# EAGLE design electretAmplifier (EAGLE 7.0.0)
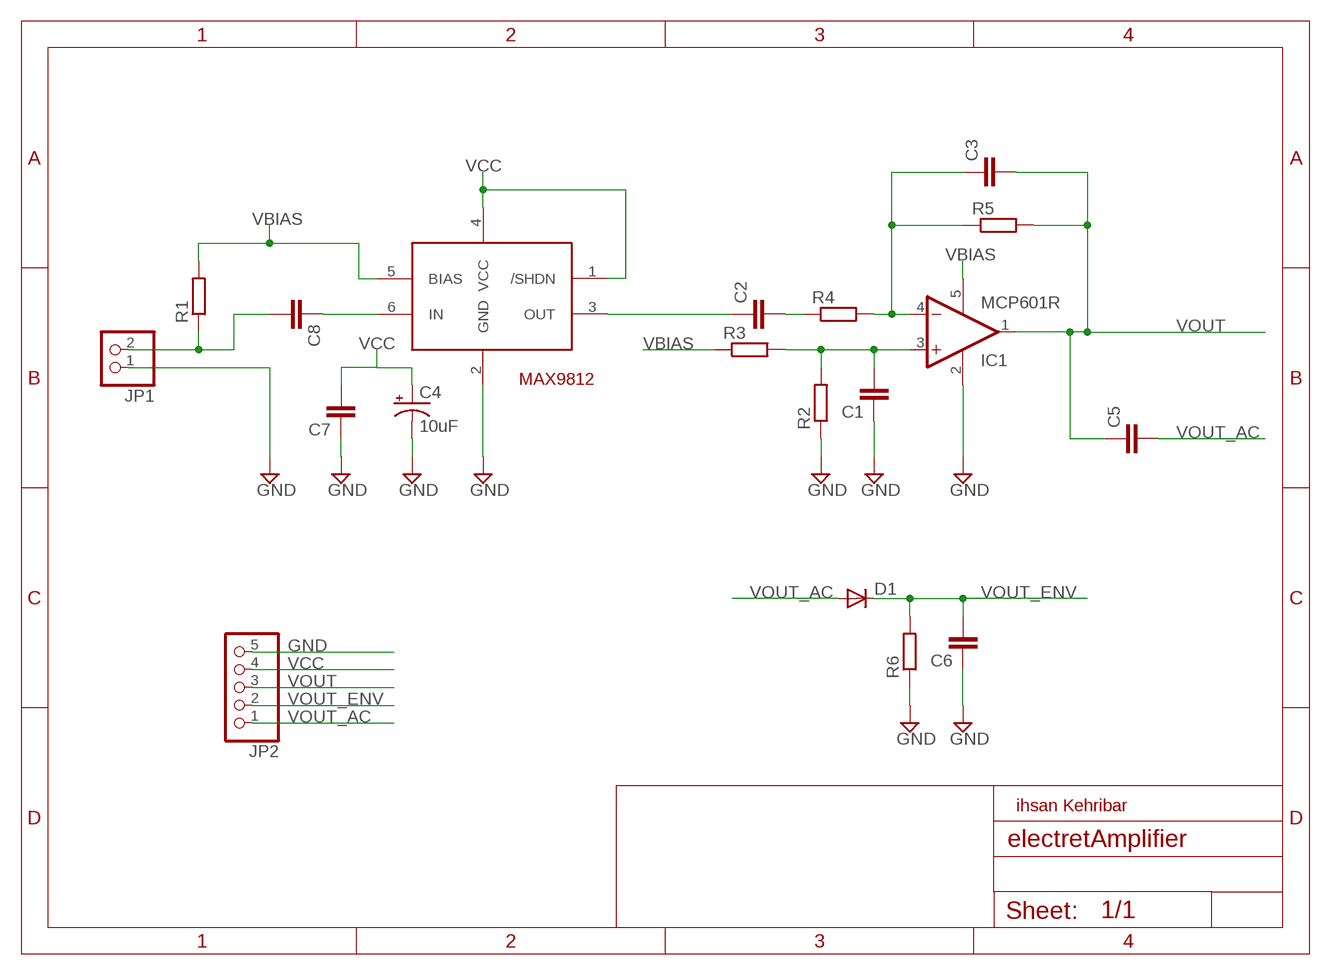
[diagram p0: schematic, sheet 1]

## Parts
C1  C-EUC0603  [C0603]
C2  C-EUC0603  [C0603]
C3  C-EUC0603  [C0603]
C4  10uF  10UF-16V-10%(TANT)  [EIA3216]
C5  C-EUC0603  [C0603]
C6  C-EUC0603  [C0603]
C7  C-EUC0603  [C0603]
C8  C-EUC0603  [C0603]
D1  DIODESOD  [SOD-323]
IC1  MCP601R  [SOT23-5]
JP1  HEADER-1X2ROUND  [1X02_ROUND]
JP2  HEADER-1X5ROUND  [1X05_ROUND]
R1  R-EU_R0603  [R0603]
R2  R-EU_R0603  [R0603]
R3  R-EU_R0603  [R0603]
R4  R-EU_R0603  [R0603]
R5  R-EU_R0603  [R0603]
R6  R-EU_R0603  [R0603]
U$1  IHSAN_MAX9812  [SC70-6]

## Nets
GND: C1.1 C4.C(-) C6.1 C7.1 IC1.2(V+) JP1.1 JP2.5 R2.1 R6.1 U$1.2(GND)
N$1: C3.1 IC1.4(-IN) R4.2 R5.1
N$2: C8.2 JP1.2 R1.1
N$3: C1.2 IC1.3(+IN) R2.2 R3.2
N$4: C2.2 R4.1
N$5: C2.1 U$1.3(OUT)
N$6: C8.1 U$1.6(IN)
VBIAS: IC1.5(V-) R1.2 R3.1 U$1.5(BIAS)
VCC: C4.A(+) C7.2 JP2.4 U$1.1(/SHDN) U$1.4(VCC)
VOUT: C3.2 C5.1 IC1.1(OUT) JP2.3 R5.2
VOUT_AC: C5.2 D1.2(A) JP2.1
VOUT_ENV: C6.2 D1.1(C) JP2.2 R6.2

## Notes on the sheet
- ihsan Kehribar

## Library data of the parts
C1-C3 C5-C8 = rcl:C-EU: CAPACITOR, European symbol
C4 = SparkFun-Capacitors:10UF-16V-10%(TANT): CAP-00811 1206/EIA-3216 Tantalum capacitor; PROD_ID: CAP-00811
D1 = SparkFun-DiscreteSemi:DIODE: Diode These are standard reverse protection diodes and small signal diodes. SMA package can handle up to about 1A. SOD-323 can handle about 200mA. What the SOD-323 package when ordering, there are some mfgs out there that are 5-pin packages.
IC1 = linear:MCP601: Single Op Amp 2.7V to 6.0V Single Supply CMOS Source: http://ww1.microchip.com/downloads/en/DeviceDoc/21314g.pdf
JP1 = microbuilder:HEADER-1X2: PIN HEADER
JP2 = microbuilder:HEADER-1X5: PIN HEADER
R1-R6 = rcl:R-EU_: RESISTOR, European symbol
U$1 = SparkFun-DigitalIC_ihsan:IHSAN_MAX9812

## Board
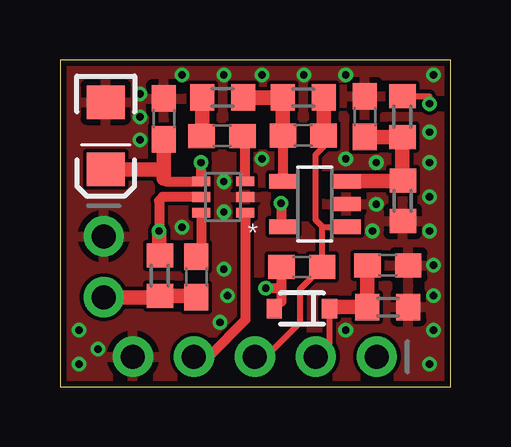
[diagram p1: board, top side]
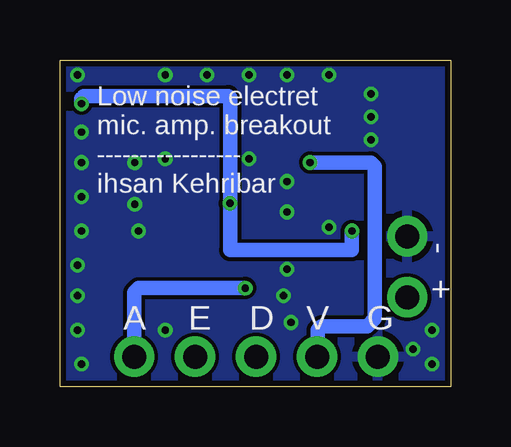
[diagram p2: board, bottom side, seen from below]

Size 16.29 x 13.65 mm. Coordinates in mm from the lower left corner, seen from the top.
Outline: 0,0 16.29,0 16.29,13.65 0,13.64 0,0
Copper layers (1*16): Top 0.035mm / dielectric 1.5mm / Bottom 0.035mm
Design rules "Fusion_eagle_rule_v1.1": minimum track width 6mil, minimum drill 12mil, track to track 6mil, track to pad 6mil, pad to pad 6mil, via to via 6mil, smd to smd 0mil, copper to edge 10mil, drill to drill 10mil, minimum pad ring 10mil, minimum via ring 6mil, stop-mask expansion 2mil, vias tented up to drill 100mil, thermal gap 10mil

### Footprints (pad centres in the part's own frame; a part is rotated, then mirrored left to right if it is on the bottom)
C0603 = smd 1.1 x 1: 1 -0.85,0; 2 0.85,0
EIA3216 = smd 1.4 x 1.6: A 1.4,0; C -1.4,0
SOD-323 = smd 0.63 x 0.83: 1 -1.15,0; 2 1.15,0
SOT23-5 = smd 0.6 x 1.2: 1 -0.95,-1.306; 2 0,-1.306; 3 0.95,-1.306; 4 0.95,1.306; 5 -0.95,1.306
1X02_ROUND = drill 1 pad 1.676: 1 -1.27,0; 2 1.27,0
1X05_ROUND = drill 1 pad 1.676: 1 -5.08,0; 2 -2.54,0; 3 0,0; 4 2.54,0; 5 5.08,0
R0603 = smd 1 x 1.1: 1 -0.85,0; 2 0.85,0
SC70-6 = smd 0.4 x 0.75: 1 -0.65,-0.925; 2 0,-0.925; 3 0.65,-0.925; 4 0.65,0.925; 5 0,0.925; 6 -0.65,0.925

### Placement (x,y rotation side)
C1  12.7,11.28 270 top
C2  6.75,10.48 180 top
C3  10.13,10.49 0 top
C4  1.91,10.48 270 top
C5  10.08,5.02 180 top
C6  13.66,5.08 180 top
C7  4.33,11.19 270 top
C8  5.68,4.59 270 top
D1  10.08,3.27 180 top
IC1  10.62,7.64 90 top
JP1  1.82,5.02 270 top
JP2  8.12,1.27 180 top
R1  4.16,4.64 90 top
R2  14.29,7.77 90 top
R3  14.27,11.28 270 top
R4  6.78,12.08 0 top
R5  10.13,12.08 0 top
R6  13.66,3.33 180 top
U$1  6.8,7.93 90 top

### Tracks (layer width: path | path; a pad name or v marks a point on that pad's centre or on a via)
GND  (via drill 0.3)
  other vias: 13.02,6.51 13.18,7.62 15.4,10.64 15.4,9.37 15.4,7.94 15.4,6.51 15.56,5.08 15.56,3.81 15.56,2.38 15.4,0.95 6.83,13.02 8.41,13.02 10.16,13.02 11.91,13.02 15.56,13.02 6.83,8.57 6.83,7.3 6.83,4.92 6.67,2.7 13.18,9.37 11.91,9.53 8.41,9.53 5.08,6.67 6.99,3.81 3.33,12.22 3.33,11.27 3.33,10.32 5.08,13.02 0.79,2.38 0.79,0.95 1.59,1.59 11.91,2.38
  pour Bottom: 0,0 0,13.65 16.3,13.65 16.3,0
  pour Top: 0,13.65 0,0 16.3,0 16.3,13.65
N$1
  Top 0.254: R5.1 | 9.29,8.62 IC1.4
  Top 0.406: C3.1 9.29,8.62
  Top 0.61: R4.2 R5.1 | R5.1 C3.1
N$2
  Top 0.254: 4.12,3.75 R1.1 | 5.63,3.79 C8.2
  Top 0.61: JP1.2 4.12,3.75 | R1.1 5.63,3.79
N$3
  Top 0.254: 14.25,8.59 R2.2 14.27,8.64
  Top 0.61: IC1.3 14.25,8.59 | C1.2 R3.2 14.27,8.64
N$4
  Top 0.254: 5.92,10.34 C2.2
  Top 0.61: R4.1 5.92,10.34
N$5
  Top 0.254: 7.73,10.2 C2.1
  Top 0.406: U$1.3 7.73,10.2
N$6
  Top 0.254: 5.88,5.64 C8.1
  Top 0.406: U$1.6 5.88,5.64
VBIAS  (via drill 0.3)
  Top 0.254: R3.1 15.39,12.13 v15.4,11.82 | 9.21,6.79 IC1.5 | 4.13,5.53 R1.2
  Top 0.406: v9.21,7.66 9.21,6.79 | U$1.5 4.28,7.93 4.13,7.78 v4.13,6.51
  Top 0.61: v4.13,6.51 4.13,5.53
  Bottom 0.254: 15.4,12.03 15.3,12.13 | 9.28,12.14 9.21,12.06 | v9.21,7.67 v9.21,7.66
  Bottom 0.61: v15.4,11.82 15.4,12.03 | 15.3,12.13 9.28,12.14 | 9.21,12.06 v9.21,7.67 9.21,5.71 4.13,5.71 v4.13,6.51
VCC  (via drill 0.3)
  Top 0.254: JP2.4 | U$1.4 | 4.3,9.08 4.33,9.05 | v5.88,9.36 v5.87,9.37
  Top 0.406: U$1.1 7.73,2.81 6.19,1.27 JP2.4 | 4.33,8.69 4.45,8.57 U$1.4 | U$1.4 v5.88,9.36
  Top 0.61: C7.2 4.33,9.05 4.33,8.69 | C4.A 4.3,9.08
  Bottom 0.254: 5.56,1.29 JP2.4
  Bottom 0.61: v5.87,9.37 3.33,9.37 3.17,9.21 3.17,2.86 3.49,2.54 5.4,2.54 5.56,2.38 5.56,1.29
VOUT
  Top 0.254: C3.2 10.98,10.03 10.64,9.68 10.64,6.99 10.95,6.67 | 10.95,6.67 11.91,6.67 IC1.1 | 10.95,6.67 10.93,6.64 C5.1 10,4.09 10,2.7 8.57,1.27 JP2.3
  Top 0.61: R5.2 C3.2
VOUT_AC  (via drill 0.3)
  Top 0.406: C5.2 9.23,4.13 | 9.23,4.13 9.23,3.57 D1.2 | v8.57,4.13 9.23,4.13
  Bottom 0.61: JP2.1 13.2,3.94 13.02,4.13 v8.57,4.13
VOUT_ENV
  Top 0.254: 11.29,3.33 D1.1 11.23,1.83 JP2.2
  Top 0.61: C6.2 R6.2 11.29,3.33

### Text on the board
tNames: *
bNames: Low noise electret / mic. amp. breakout / ----------------- / ihsan Kehribar | - | + | G | V | D | E | A